# Altium schematic sheet 4_Power.SchDoc
size A4
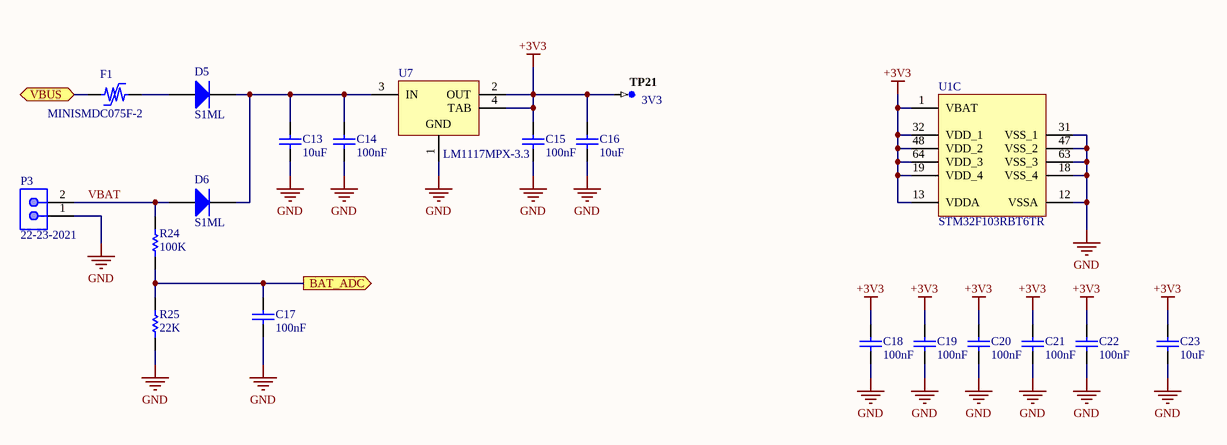
[diagram p0: 4_Power.SchDoc]

## Parts
C13  10uF  [CAPC1206(3216)130_L]
C14  100nF  [CAPC0603(1608)100_M]
C15  100nF  [CAPC0603(1608)100_M]
C16  10uF  [CAPC1206(3216)130_L]
C17  100nF  [CAPC0603(1608)100_M]
C18  100nF  [CAPC0603(1608)100_M]
C19  100nF  [CAPC0603(1608)100_M]
C20  100nF  [CAPC0603(1608)100_M]
C21  100nF  [CAPC0603(1608)100_M]
C22  100nF  [CAPC0603(1608)100_M]
C23  10uF  [CAPC1206(3216)130_L]
D5  S1ML  [TWS-S1ML_V]
D6  S1ML  [TWS-S1ML_V]
F1  MINISMDC075F-2  [TECO-MINISMDC075F_V]
P3  22-23-2021  [MOLX-22-23-2021_V]
R24  100K  [RESC0603(1608)_M]
R25  22K  [RESC0603(1608)_M]
TP21  3V3  [TP-SM-C-100]  (no BOM)
U1  STM32F103RBT6TR  [STM-LQFP64_N]  (part C of 3)
U7  LM1117MPX-3.3  [MP04A_N]

## Ports
BAT_ADC (out), VBUS (bidir)

## Nets
+3V3: C15.2 C16.2 C18.2 C19.2 C20.2 C21.2 C22.2 C23.2 TP21.1 U1.1(VBAT) U1.13(VDDA) U1.19(VDD_4) U1.32(VDD_1) U1.48(VDD_2) U1.64(VDD_3) U7.2(OUT) U7.4(TAB)
GND: C13.1 C14.1 C15.1 C16.1 C17.1 C18.1 C19.1 C20.1 C21.1 C22.1 C23.1 P3.1 R25.1 U1.12(VSSA) U1.18(VSS_4) U1.31(VSS_1) U1.47(VSS_2) U1.63(VSS_3) U7.1(GND)
BAT_ADC: C17.2 R24.1 R25.2 ; port BAT_ADC
VBAT: D6.1(A) P3.2 R24.2
VBUS: F1.1 ; port VBUS
NetC13_2: C13.2 C14.2 D5.2(K) D6.2(K) U7.3(IN)
NetD5_1: D5.1(A) F1.2

## Library data of the parts
C13 C16 C23 = CMP-1037-04977-1: CAP 10uF 16V -20% to +80% 1206 (3216 Metric) Thickness 1.3mm SMD; Case-EIA: 1206; Case-Metric: 3216; Rated Voltage: 16 V; Tolerance: -20% to +80%; Technology: SMT; Value: 10uF; Max Thickness: 1.3 mm
C14 C15 C17-C22 = CMP-1035-02589-1: CAP 100nF 25V ±20% 0603 (1608 Metric) Thickness 1mm SMD; Case-EIA: 0603; Tolerance: Â±20%; Case-Metric: 1608; Value: 100nF; Max Thickness: 1 mm; Technology: SMT; Rated Voltage: 25 V
D5 D6 = CMP-2000-07014-1: Rectifier, 1 A, 1.1 V, -55 to 175 degC, 2-Pin SMD, RoHS, Tape and Reel; Manufacturer: Taiwan Semiconductor; Forward Current If(AV): 1A; Forward Voltage VF Max: 1.1V; Diode Configuration: Single; Reverse Recovery Time trr Max: 1.8µs; Forward Surge Current Ifsm Max: 30A; SVHC: NoSVHC(15-Jun-2015); Repetitive Reverse Voltage Vrrm Max: 1kV; No. of Pins: 2Pin; Mounting Technology: SurfaceMount; Package Reference: S1ML; Datasheet URL: http://www.taiwansemi.com/products/datasheet/S1AL%20SERIES_O15.pdf; Manufacturer URL: http://www.taiwansemi.com/; Package Description: 2-Pin Surface Mount Device, Body 2.8 x 1.8 mm; Product Range: -; Diode Case Style: SMD; Datasheet Version: Rev. O15, 05/2015; Packaging: CutTape; Operating Temperature Max: 150°C
F1 = CMP-2000-06707-1: PolySwitch Resettable Device, 13.2 V, 0.75 A, -40 to 85 degC, 2-Pin SMD, RoHS, Tape and Reel; Manufacturer: TE Connectivity; Product Range: PolySwitchminiSMDCSeries; Voltage Rating: 13.2VDC; Operating Voltage: 13.2 / V; Initial Resistance Max: 0.45 / ohm; SVHC: NoSVHC(15-Jun-2015); Holding Current: 750mA; Tripping Current: 1.5A; Operating Temperature Max: 85°C; Package Reference: MINISMDC075F; Package Description: 2-Pin Surface Mount Device, Body 4.55 x 3.24 mm; Thermistor Mounting: SMD; PTC Fuse Case Style: SMD; Manufacturer URL: http://www.te.com/; Datasheet URL: http://www.te.com/commerce/DocumentDelivery/DDEController?Action=srchrtrv&DocNm=CLP00010&DocType=CS&DocLang=English; Operating Temperature Min: -40°C; Mounting Technology: SurfaceMount; Datasheet Version: 11/2013
P3 = CMP-1704-00001-1: Male Header, Pitch 2.54 mm, 1 x 2 Position, Height 10.67 mm, Tail Length 3.56 mm, 0 to 75 degC, RoHS, Bulk; Manufacturer: Molex; PackageDescription: Male Header, Pitch 2.54 mm, 1 x 2 Position, Height 10.67 mm, Tail Length 3.56 mm; ComponentLink2URL: https://datasheet.ciiva.com/19454/232266-19454304.pdf; ComponentLink2Description: Datasheet; ComponentLink1Description: Manufacturer URL; PartNumber: 22-23-2021; Mounting Technology: Through Hole; ComponentLink1URL: http://www.molex.com/; PackageReference: 22-23-2021
R24 = CMP-1012-00736-1: 100K 0.1W 1% 0603 (1608 Metric)  SMD; Value: 100000.00 Ohm; Case-Metric: 1608; Case-EIA: 0603; Power: 0.1 W; Tolerance: 1 %; Technology: SMT
R25 = CMP-1012-00659-1: 22K 0.1W 1% 0603 (1608 Metric)  SMD; Case-EIA: 0603; Value: 22000.00 Ohm; Case-Metric: 1608; Technology: SMT; Power: 0.1 W; Tolerance: 1 %
TP21 = CMP-0484-00002-2: Test Point, Surface Mount, Circular, Pad Diameter 1 mm; Manufacturer: No Vendor; PartNumber: TP-SM-C-100
U1 = CMP-0237-00169-2: ARM Cortex-M3 32-bit MCU, 128 KB Flash, 20 KB Internal RAM, 51 I/Os, 64-pin LQFP, -40 to 85 degC, Tape and Reel; Supply Voltage(Vcc) min (V): 2; A/D Converter: 2x12-bit (16 Channel); FLASH Size (Prog) (kB): 128; I/Os (High Current): 51; Operating Frequency(F) (Processor speed) (MHz): 72; Internal RAM Size (kB): 20; ComponentLink2URL: http://www.st.com/st-web-ui/static/active/en/resource/technical/document/datasheet/CD00161566.pdf; ComponentLink2Description: Datasheet; ComponentLink1Description: Manufacturer URL; Packing: Tape and Reel; PackageReference: LQFP64; ComponentLink1URL: http://www.st.com/web/en/home.html; Mounting Technology: Surface Mount; DatasheetVersion: Rev. 16; PartNumber: STM32F103RBT6TR; Core: ARM Cortex-M3; ComponentLink3URL: http://www.st.com/st-web-ui/static/active/en/resource/technical/document/datasheet/DM00037051.pdf; PackageDescription: 64-Pin Low Profile Quad Flat Package, 10 x 10 mm Body, 0.5 mm Pitch; PackageVersion: Rev. 4, 06/2013; ComponentLink3Description: Package Specification; PartId: 1
U7 = CMP-0062-01659-3: 800mA Low-Dropout Linear Regulator, 4-pin SOT-223; Manufacturer: National Semiconductor; PowerWise: N; High-Reliability: Y; PackageTopMarking: XYTT*N05A; CompType: LDO IC; DatasheetVersion: Apr-2006; PackageDescription: Molded SOT-223, 6.50 x 3.56 x 1.6mm Body, 4 Lead, 2.3mm Pitch; ComponentLink1Description: Manufacturer URL; ComponentLink4Description: MP04A Package Page; PartNumber: LM1117MPX-3.3; ComponentLink3URL: http://www.national.com/pf/LM/LM1117.html; ComponentLink2Description: LM1117 Datasheet; Code_JEDEC: TO-261-AA; ComponentLink4URL: http://www.national.com/packaging/folders/mp04a.html; Code_IPC: SOT223-4; RevisionNote: SCH symbol layout adjusted; PackageVersion: revB, Apr-2003; RoHS: N; PackageReference: MP04A; ComponentLink1URL: http://www.national.com/; ComponentLink2URL: http://www.national.com/ds/LM/LM1117.pdf; PinCount: 4; ComponentLink3Description: LM1117 Web Page